# Altium project ESP-LED-Board.PrjPCB
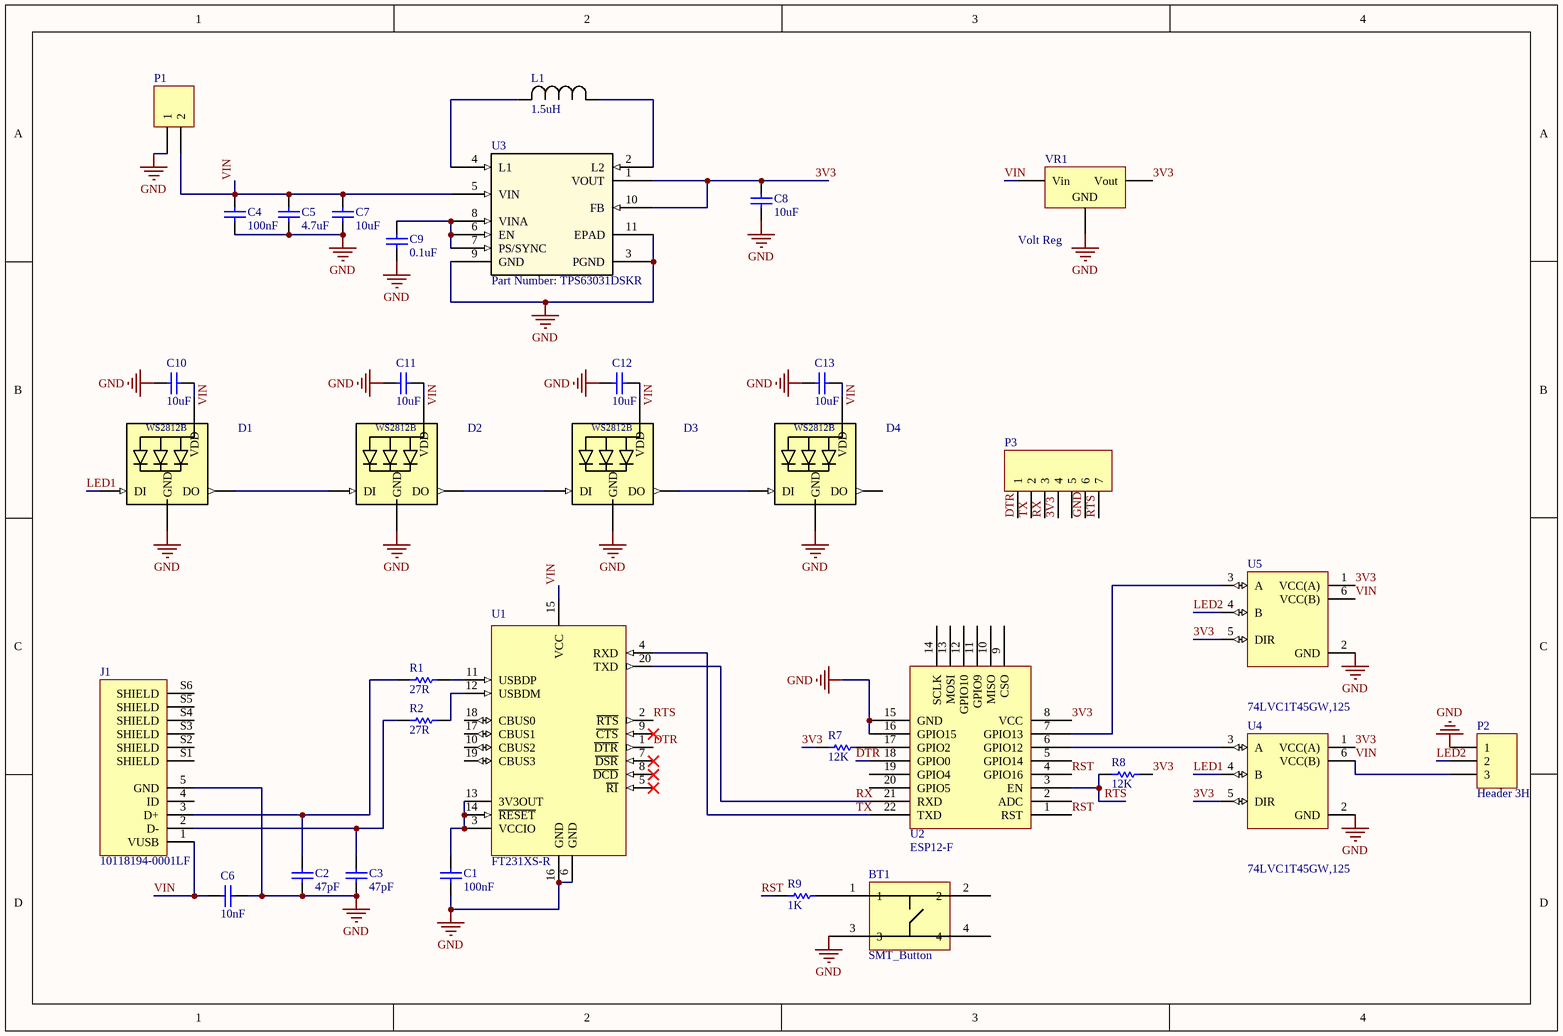
[diagram p0: ESP-LED-Schematic.SchDoc]
1 sheet, 34 parts. Net scope: global (net labels, ports and power ports of the same name join across sheets).
Board file: ESP-LED-5x5PCB.PcbDoc

## Sheet ESP-LED-Schematic.SchDoc
size A4

### Parts
BT1  SMT_Button  [SMT_Button]
C1  100nF  [6-0805_M]
C2  47pF  [6-0805_M]
C3  47pF  [6-0805_M]
C4  100nF  [6-0805_M]
C5  4.7uF  [6-0805_M]
C6  10nF  [6-0805_M]
C7  10uF  [6-0805_M]
C8  10uF  [6-0805_M]
C9  0.1uF  [6-0805_M]
C10  10uF  [6-0805_M]
C11  10uF  [6-0805_M]
C12  10uF  [6-0805_M]
C13  10uF  [6-0805_M]
D1  WS2812B  [*WS2812B_WS2812B(Primary)]  (value not drawn)
D2  WS2812B  [*WS2812B_WS2812B(Primary)]  (value not drawn)
D3  WS2812B  [*WS2812B_WS2812B(Primary)]  (value not drawn)
D4  WS2812B  [*WS2812B_WS2812B(Primary)]  (value not drawn)
J1  10118194-0001LF  [*AMPHENOL_10118194-0001LF_10118194-0001LF(Primary)]
L1  1.5uH  [DFE252012P-1R0M=]
P1  Header 2  [Molex_53048-0210_0]  (value not drawn)
P2  Header 3H  [HDR1X3H]
P3  Header 7  [HDR1X7]  (value not drawn)
R1  27R  [6-0805_M]
R2  27R  [6-0805_M]
R7  12K  [6-0805_M]
R8  12K  [6-0805_M]
R9  1K  [6-0805_M]
U1  FT231XS-R  [*SOP63P599X175-20N]
U2  ESP12-F  [ESP12-F]
U3  Part Number: TPS63031DSKR  [DSK10_2X1P2]
U4  74LVC1T45GW,125  [*SOT65P210X110-6N]
U5  74LVC1T45GW,125  [*SOT65P210X110-6N]
VR1  Volt Reg  [SOT223_N]

### Nets
GND: BT1.3 C1.1 C2.2 C3.2 C4.2 C5.2 C6.1 C7.1 C8.1 C9.1 C10.2 C11.2 C12.2 C13.2 D1.3-GND(GND) D2.3-GND(GND) D3.3-GND(GND) D4.3-GND(GND) J1.5(GND) P1.1 P2.1 P3.6 U1.6(GND) U1.16(GND) U2.15(GND) U2.16(GPIO15) U3.3(PGND) U3.9(GND) U3.11(EPAD) U4.2(GND) U5.2(GND) VR1.2(GND)
3V3: C8.2 P3.4 R7.1 R8.1 U2.8(VCC) U3.1(VOUT) U3.10(FB) U4.1(VCC(A)) U4.5(DIR) U5.1(VCC(A)) U5.5(DIR) VR1.3(Vout)
DTR: P3.1 U1.1(~{DTR}) U2.18(GPIO0)
LED1: D1.4-DIN(DI) U4.4(B)
LED2: P2.2 U5.4(B)
RST: R9.2 U2.1(RST) U2.4(GPIO16)
RTS: P3.7 R8.2 U1.2(~{RTS}) U2.3(EN)
RX: P3.3 U1.20(TXD) U2.21(RXD)
TX: P3.2 U1.4(RXD) U2.22(TXD)
VIN: C4.1 C5.1 C6.2 C7.2 C10.1 C11.1 C12.1 C13.1 D1.1-VDD(VDD) D2.1-VDD(VDD) D3.1-VDD(VDD) D4.1-VDD(VDD) J1.1(VUSB) P1.2 P2.3 U1.15(VCC) U3.5(VIN) U4.6(VCC(B)) U5.6(VCC(B)) VR1.1(Vin)
NetBT1_1: BT1.1 R9.1
NetC1_2: C1.2 U1.3(VCCIO) U1.13(3V3OUT) U1.14(~{RESET})
NetC2_1: C2.1 J1.3(D+) R1.1
NetC3_1: C3.1 J1.2(D-) R2.1
NetC9_2: C9.2 U3.6(EN) U3.7(PS/SYNC) U3.8(VINA)
NetD1_2-DOUT: D1.2-DOUT(DO) D2.4-DIN(DI)
NetD2_2-DOUT: D2.2-DOUT(DO) D3.4-DIN(DI)
NetD3_2-DOUT: D3.2-DOUT(DO) D4.4-DIN(DI)
NetL1_1: L1.1 U3.2(L2)
NetL1_2: L1.2 U3.4(L1)
NetR1_2: R1.2 U1.11(USBDP)
NetR2_2: R2.2 U1.12(USBDM)
NetR7_2: R7.2 U2.17(GPIO2)
NetU2_6: U2.6(GPIO12) U4.3(A)
NetU2_7: U2.7(GPIO13) U5.3(A)

Not connected (* = marked no-connect by the designer): BT1 2 4; D4 2-DOUT(DO); J1 4(ID) S1(SHIELD) S2(SHIELD) S3(SHIELD) S4(SHIELD) S5(SHIELD) S6(SHIELD); P3 5; U1 5(~{RI})* 7(~{DSR})* 8(~{DCD})* 9(~{CTS})* 10(CBUS2) 17(CBUS1) 18(CBUS0) 19(CBUS3); U2 2(ADC) 5(GPIO14) 9(CSO) 10(MISO) 11(GPIO9) 12(GPIO10) 13(MOSI) 14(SCLK) 19(GPIO4) 20(GPIO5)

### Library data of the parts
C1-C13 = Cap: Capacitor; Value: 100pF; Published: 8-Jun-2000; LatestRevisionDate: 17-Jul-2002; LatestRevisionNote: Re-released for DXP Platform.; PackageReference: RAD-0.3; Publisher: Altium Limited; PackageDescription: Radial Cap, Thru-Hole; 2 Leads; 0.3 in Pin Spacing
D1-D4 = WS2812B: Intelligent Control Led Integrated Light Source Pack Of 10; MF: Worldsemi; Digi-Key_Part_Number: 1597-1565-ND; SnapEDA_Link: https://www.snapeda.com/parts/WS2812B/Seeed%20Technology%20Co.%2C%20Ltd/view-part/?ref=snap; Package: None; Digi-Key_Purchase_URL: https://www.digikey.ca/product-detail/en/seeed-technology-co-ltd/110060865/1597-1565-ND/7650479?utm_source=snapeda&utm_medium=aggregator&utm_campaign=symbol; MP: WS2812B; Value: *
J1 = 10118194-0001LF: Micro Usb, 2.0 Type b, Rcpt, Smt; MF: Amphenol ICC; MP: 10118194-0001LF; Package: None; SnapEDA_Link: https://www.snapeda.com/parts/10118194-0001LF/Amphenol%20ICC/view-part/?ref=snap; Price: None; Availability: Unavailable; Value: *
L1 = DFE252012P-1R5M=: No Description Available; Manufacturer_Part_Number: DFE252012P-1R5M=P2; Vendor: Murata; Built_By: EMA_UL_Team; Type: DEV; Copyright: Copyright (C) 2018 Accelerated Designs. All rights reserved; RefDes: RefDes; Value: Value
P1 = Header 2: Header, 2-Pin; LatestRevisionDate: 17-Jul-2002; LatestRevisionNote: Re-released for DXP Platform.; Publisher: Altium Limited
P2 = Header 3H: Header, 3-Pin, Right Angle; LatestRevisionDate: 17-Jul-2002; LatestRevisionNote: Re-released for DXP Platform.; Publisher: Altium Limited
P3 = Header 7: Header, 7-Pin; LatestRevisionDate: 17-Jul-2002; LatestRevisionNote: Re-released for DXP Platform.; Publisher: Altium Limited
R1 R2 R7 R8 = Res1: Resistor; Value: 1K; Published: 8-Jun-2000; LatestRevisionDate: 17-Jul-2002; LatestRevisionNote: Re-released for DXP Platform.; PackageReference: AXIAL-0.3; Publisher: Altium Limited; PackageDescription: Axial Device, Thru-Hole; 2 Leads; 0.3 in Pin Spacing
R9 = Res1: Resistor; Published: 8-Jun-2000; LatestRevisionDate: 17-Jul-2002; LatestRevisionNote: Re-released for DXP Platform.; PackageReference: AXIAL-0.3; Publisher: Altium Limited; PackageDescription: Axial Device, Thru-Hole; 2 Leads; 0.3 in Pin Spacing; Value: 1K
U1 = FT231XS-R: USB Full Speed to Full Handshake UART with USB Charger Detection; MF: FTDI,; SnapEDA_Link: https://www.snapeda.com/parts/FT231XS-R/FTDI%2C%20Future%20Technology%20Devices%20International%20Ltd/view-part/?ref=snap; Digi-Key_Part_Number: 768-1129-1-ND; MP: FT231XS-R; Digi-Key_Purchase_URL: https://www.digikey.com/product-detail/en/ftdi-future-technology-devices-international-ltd/FT231XS-R/768-1129-1-ND/3029151?utm_source=snapeda&utm_medium=aggregator&utm_campaign=symbol; Package: SSOP-20 FTDI; Value: *
U3 = TPS63031DSKR: No Description Available; Vendor: Texas Instruments; Built_By: EMA_UL_Team; Manufacturer_Part_Number: TPS63031DSKR; Manufacturer: Texas Instruments; Copyright: Copyright (C) 2018 Accelerated Designs. All rights reserved; RefDes: RefDes; Type: DEV; Value: Value
U4 U5 = 74LVC1T45GW,125: 74LVC_H_1T45 - Dual supply translating transceiver; 3-state; MF: Nexperia USA; Package: SOT-363 Nexperia USA; SnapEDA_Link: https://www.snapeda.com/parts/74LVC1T45GW%2C125/Nexperia%20USA%20Inc./view-part/?ref=snap; Availability: Unavailable; MP: 74LVC1T45GW,125; Price: None; Value: *
VR1 = Volt Reg: Voltage Regulator; pin to pad: 1>3 2>1 3>2; Published: 24-Mar-1999; LatestRevisionDate: 29-May-2009; LatestRevisionNote: IPC-7351 Footprint Added.; PackageReference: D2PAK; Publisher: Altium Limited; PackageDescription: 3-Pin Transistor Outline Package 2.54 mm Pitch, 15.1 mm Lead Span